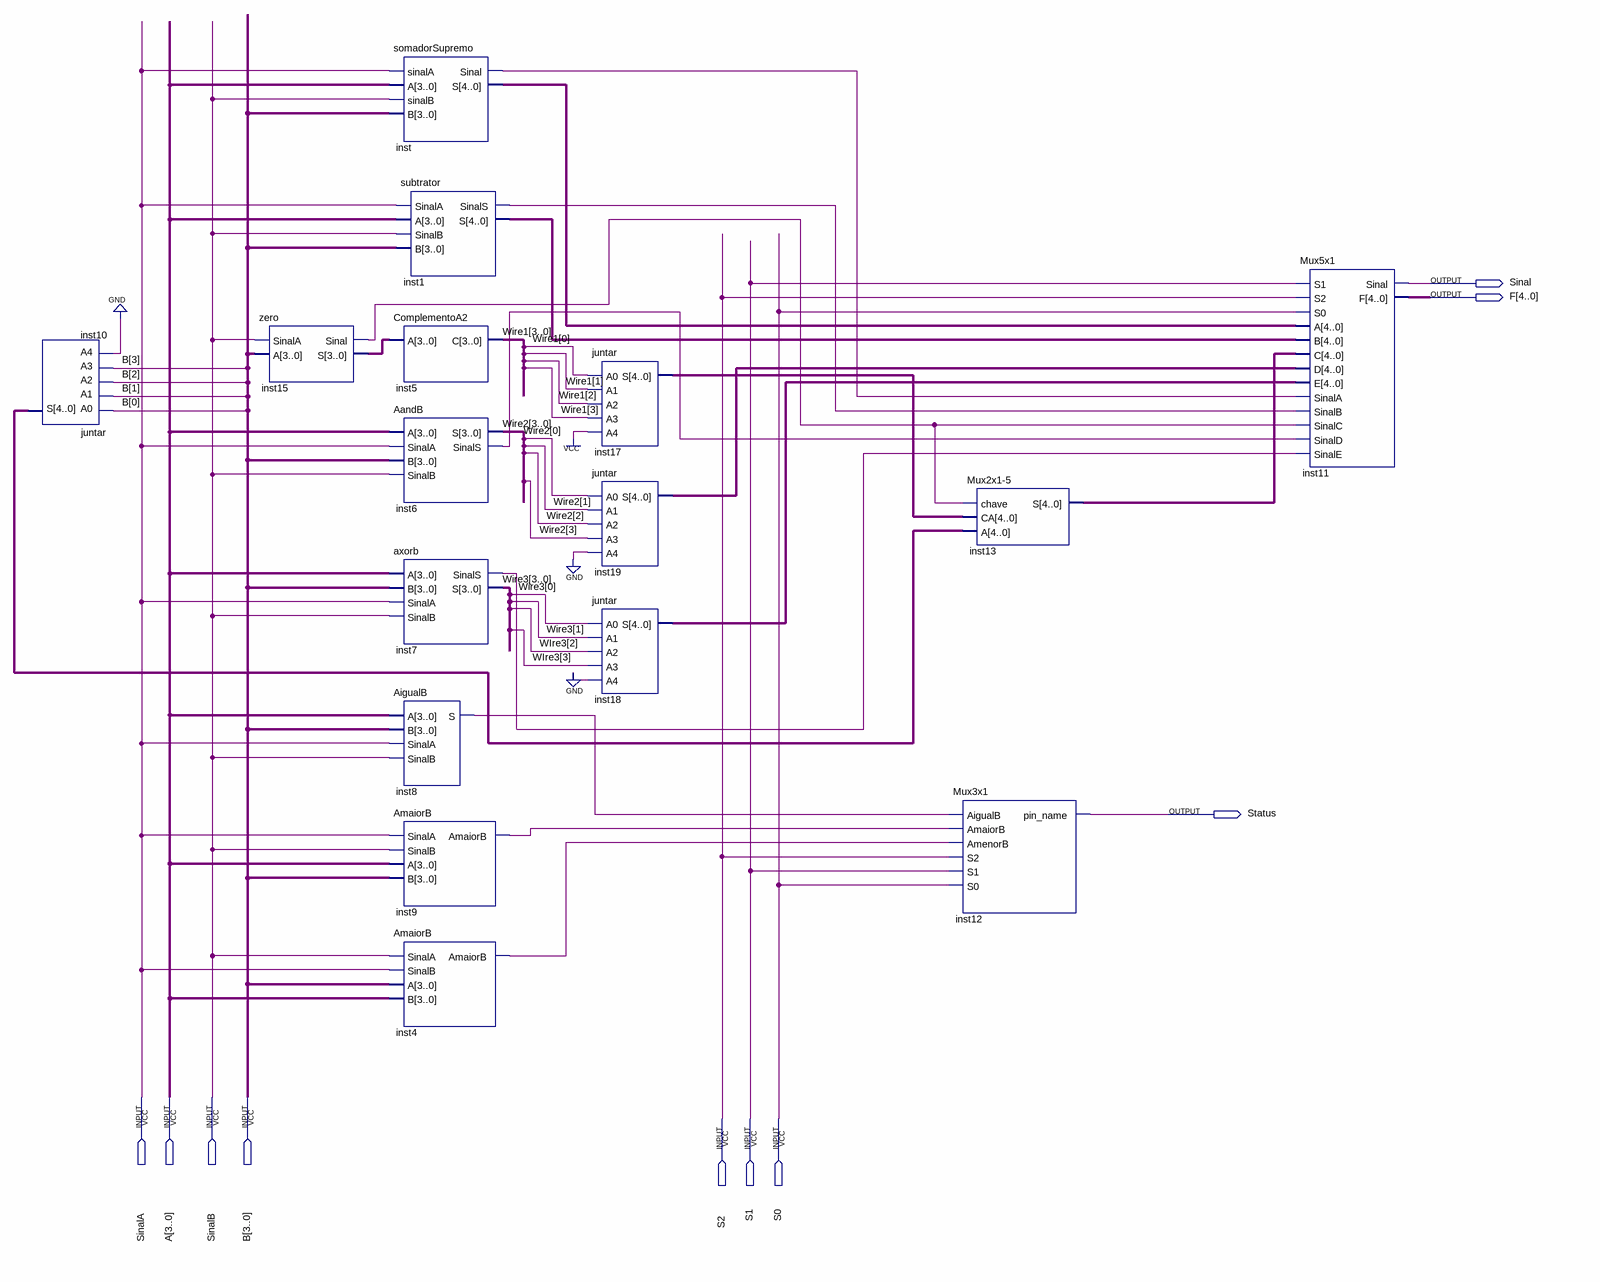
[diagram p0: schematic sheet]
// Quartus schematic ULA.bdf as structural Verilog: 16 symbols, 10 pins
module ULA (
  input  SinalA,
  input  [3:0] A,
  input  SinalB,
  input  [3:0] B,
  input  S2,
  input  S1,
  input  S0,
  output Sinal,
  output [4:0] F,
  output Status
);

  wire inst1_sinals, inst4_amaiorb, inst6_sinals, inst7_sinals, inst8_s, inst9_amaiorb, inst15_sinal,
       inst_sinal;
  wire [3:0] inst15_s, Wire1, Wire2, Wire3;
  wire [4:0] inst1_s, inst10_s, inst13_s, inst17_s, inst18_s, inst19_s, inst_s;

  juntar inst10 (.A0(B[0]), .A1(B[1]), .A2(B[2]), .A3(B[3]), .A4(1'b0), .S(inst10_s));
  zero inst15 (.SinalA(SinalB), .A(B), .Sinal(inst15_sinal), .S(inst15_s));
  somadorSupremo inst (.sinalA(SinalA), .A(A), .sinalB(SinalB), .B(B), .Sinal(inst_sinal), .S(inst_s));
  subtrator inst1 (.SinalA(SinalA), .A(A), .SinalB(SinalB), .B(B), .SinalS(inst1_sinals), .S(inst1_s));
  ComplementoA2 inst5 (.A(inst15_s), .C(Wire1));
  AandB inst6 (.A(A), .SinalA(SinalA), .B(B), .SinalB(SinalB), .S(Wire2), .SinalS(inst6_sinals));
  axorb inst7 (.A(A), .B(B), .SinalA(SinalA), .SinalB(SinalB), .SinalS(inst7_sinals), .S(Wire3));
  AigualB inst8 (.A(A), .B(B), .SinalA(SinalA), .SinalB(SinalB), .S(inst8_s));
  AmaiorB inst9 (.SinalA(SinalA), .SinalB(SinalB), .A(A), .B(B), .AmaiorB(inst9_amaiorb));
  AmaiorB inst4 (.SinalA(SinalB), .SinalB(SinalA), .A(B), .B(A), .AmaiorB(inst4_amaiorb));
  juntar inst17 (.A0(Wire1[0]), .A1(Wire1[1]), .A2(Wire1[2]), .A3(Wire1[3]), .A4(1'b1), .S(inst17_s));
  juntar inst19 (.A0(Wire2[0]), .A1(Wire2[1]), .A2(Wire2[2]), .A3(Wire2[3]), .A4(1'b0), .S(inst19_s));
  juntar inst18 (.A0(Wire3[0]), .A1(Wire3[1]), .A2(Wire3[2]), .A3(Wire3[3]), .A4(1'b0), .S(inst18_s));
  Mux3x1 inst12 (
    .AigualB(inst8_s), .AmaiorB(inst9_amaiorb), .AmenorB(inst4_amaiorb), .S2(S2), .S1(S1), .S0(S0),
    .pin_name(Status));
  \Mux2x1-5  inst13 (.chave(inst15_sinal), .CA(inst17_s), .A(inst10_s), .S(inst13_s));
  Mux5x1 inst11 (
    .S1(S1), .S2(S2), .S0(S0), .A(inst_s), .B(inst1_s), .C(inst13_s), .D(inst19_s), .E(inst18_s),
    .SinalA(inst_sinal), .SinalB(inst1_sinals), .SinalC(inst15_sinal), .SinalD(inst6_sinals),
    .SinalE(inst7_sinals), .Sinal(Sinal), .F(F));
endmodule
